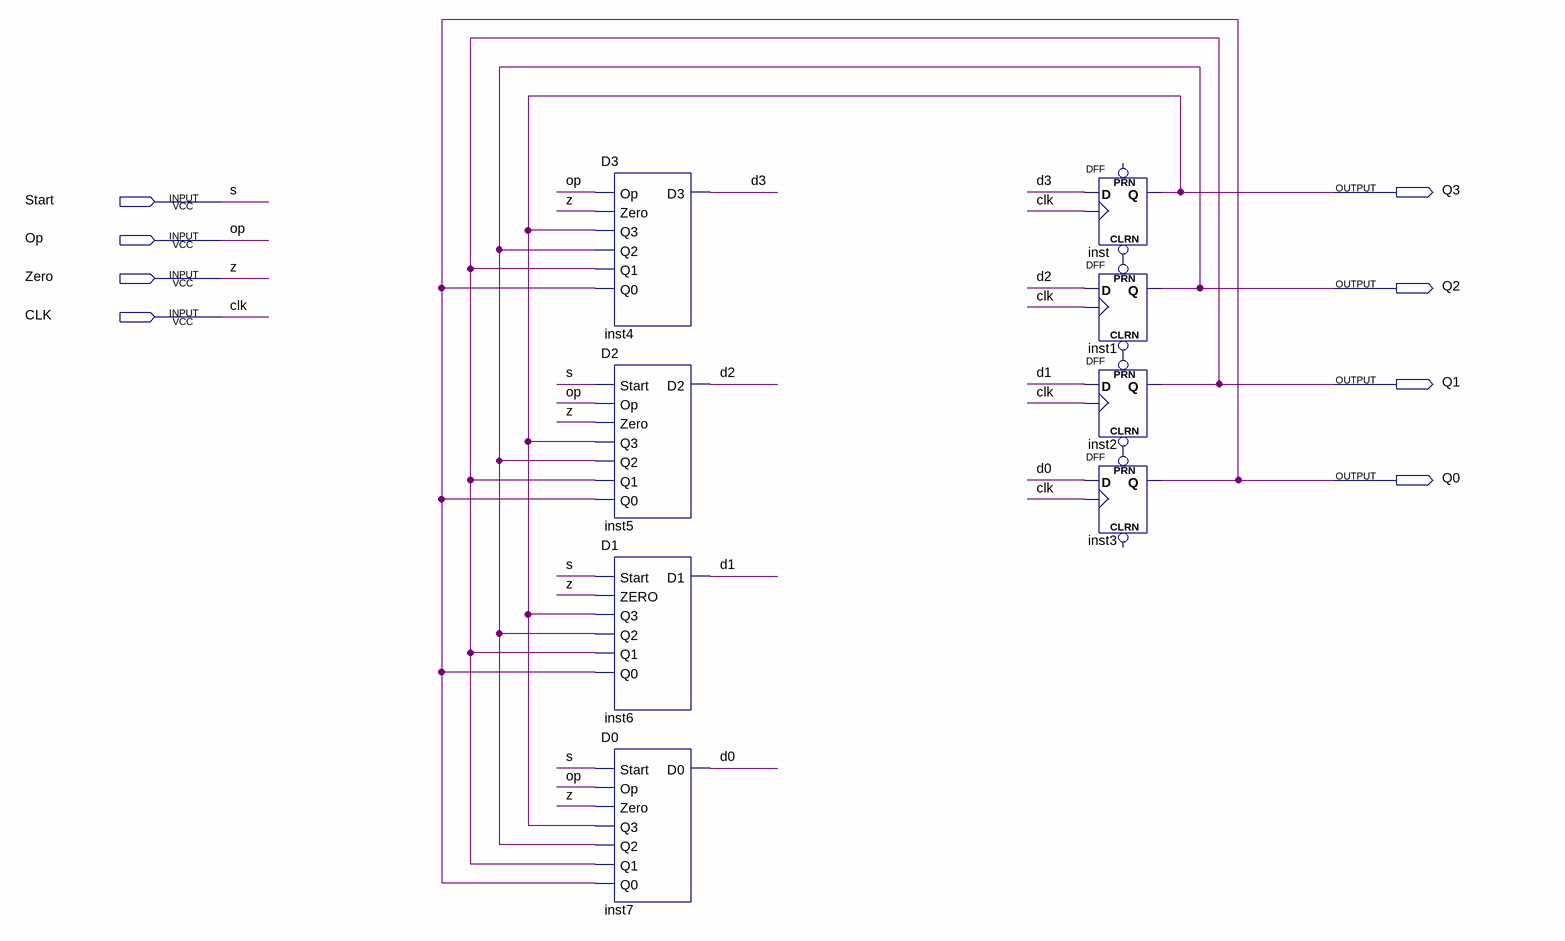
[diagram p0: schematic sheet]
// Quartus schematic FSM.bdf as structural Verilog: 8 symbols, 8 pins
module FSM (
  input  Start,
  input  Op,
  input  Zero,
  input  CLK,
  output Q3,
  output Q2,
  output Q1,
  output Q0
);

  wire d0, d1, d2, d3, undriven, undriven_2, undriven_3;

  D3 inst4 (.Op(Op), .Zero(Zero), .Q3(Q3), .Q2(Q2), .Q1(Q1), .Q0(Q0), .D3(d3));
  D2 inst5 (.Start(Start), .Op(Op), .Zero(Zero), .Q3(Q3), .Q2(Q2), .Q1(Q1), .Q0(Q0), .D2(d2));
  D1 inst6 (.Start(Start), .ZERO(Zero), .Q3(Q3), .Q2(Q2), .Q1(Q1), .Q0(Q0), .D1(d1));
  D0 inst7 (.Start(Start), .Op(Op), .Zero(Zero), .Q3(Q3), .Q2(Q2), .Q1(Q1), .Q0(Q0), .D0(d0));
  DFF inst (.CLRN(undriven), .CLK(CLK), .D(d3), .Q(Q3));  // open: PRN
  DFF inst1 (.CLRN(undriven_2), .CLK(CLK), .D(d2), .PRN(undriven), .Q(Q2));
  DFF inst2 (.CLRN(undriven_3), .CLK(CLK), .D(d1), .PRN(undriven_2), .Q(Q1));
  DFF inst3 (.CLK(CLK), .D(d0), .PRN(undriven_3), .Q(Q0));  // open: CLRN

  // Other names for the same wires on the sheet: s = Start; z = Zero
endmodule
